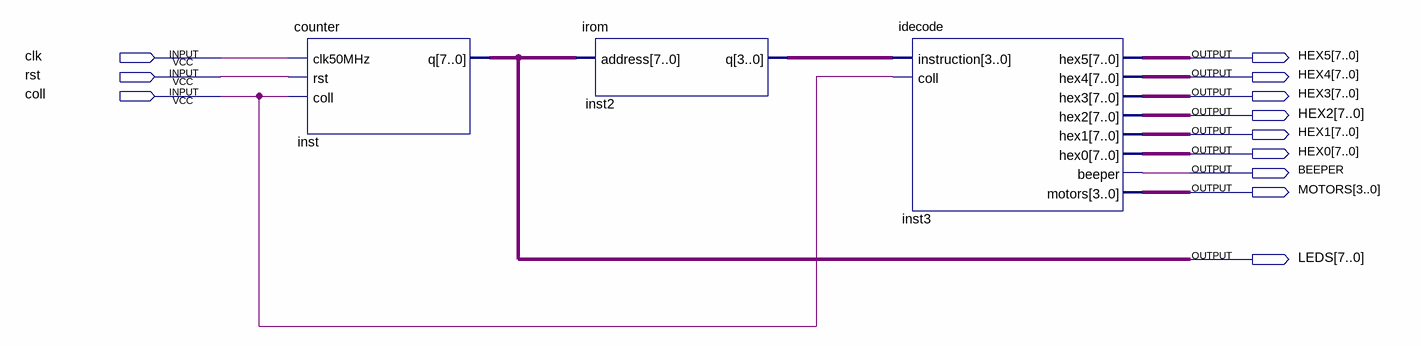
[diagram p0: schematic sheet]
// Quartus schematic lab7.bdf as structural Verilog: 3 symbols, 12 pins
module lab7 (
  input  clk,
  input  rst,
  input  coll,
  output [7:0] HEX5,
  output [7:0] HEX4,
  output [7:0] HEX3,
  output [7:0] HEX2,
  output [7:0] HEX1,
  output [7:0] HEX0,
  output BEEPER,
  output [3:0] MOTORS,
  output [7:0] LEDS
);

  wire [3:0] inst2_q;

  counter inst (.clk50MHz(clk), .rst(rst), .coll(coll), .q(LEDS));
  irom inst2 (.address(LEDS), .q(inst2_q));
  idecode inst3 (
    .instruction(inst2_q), .coll(coll), .hex5(HEX5), .hex4(HEX4), .hex3(HEX3), .hex2(HEX2), .hex1(HEX1),
    .hex0(HEX0), .beeper(BEEPER), .motors(MOTORS));
endmodule
